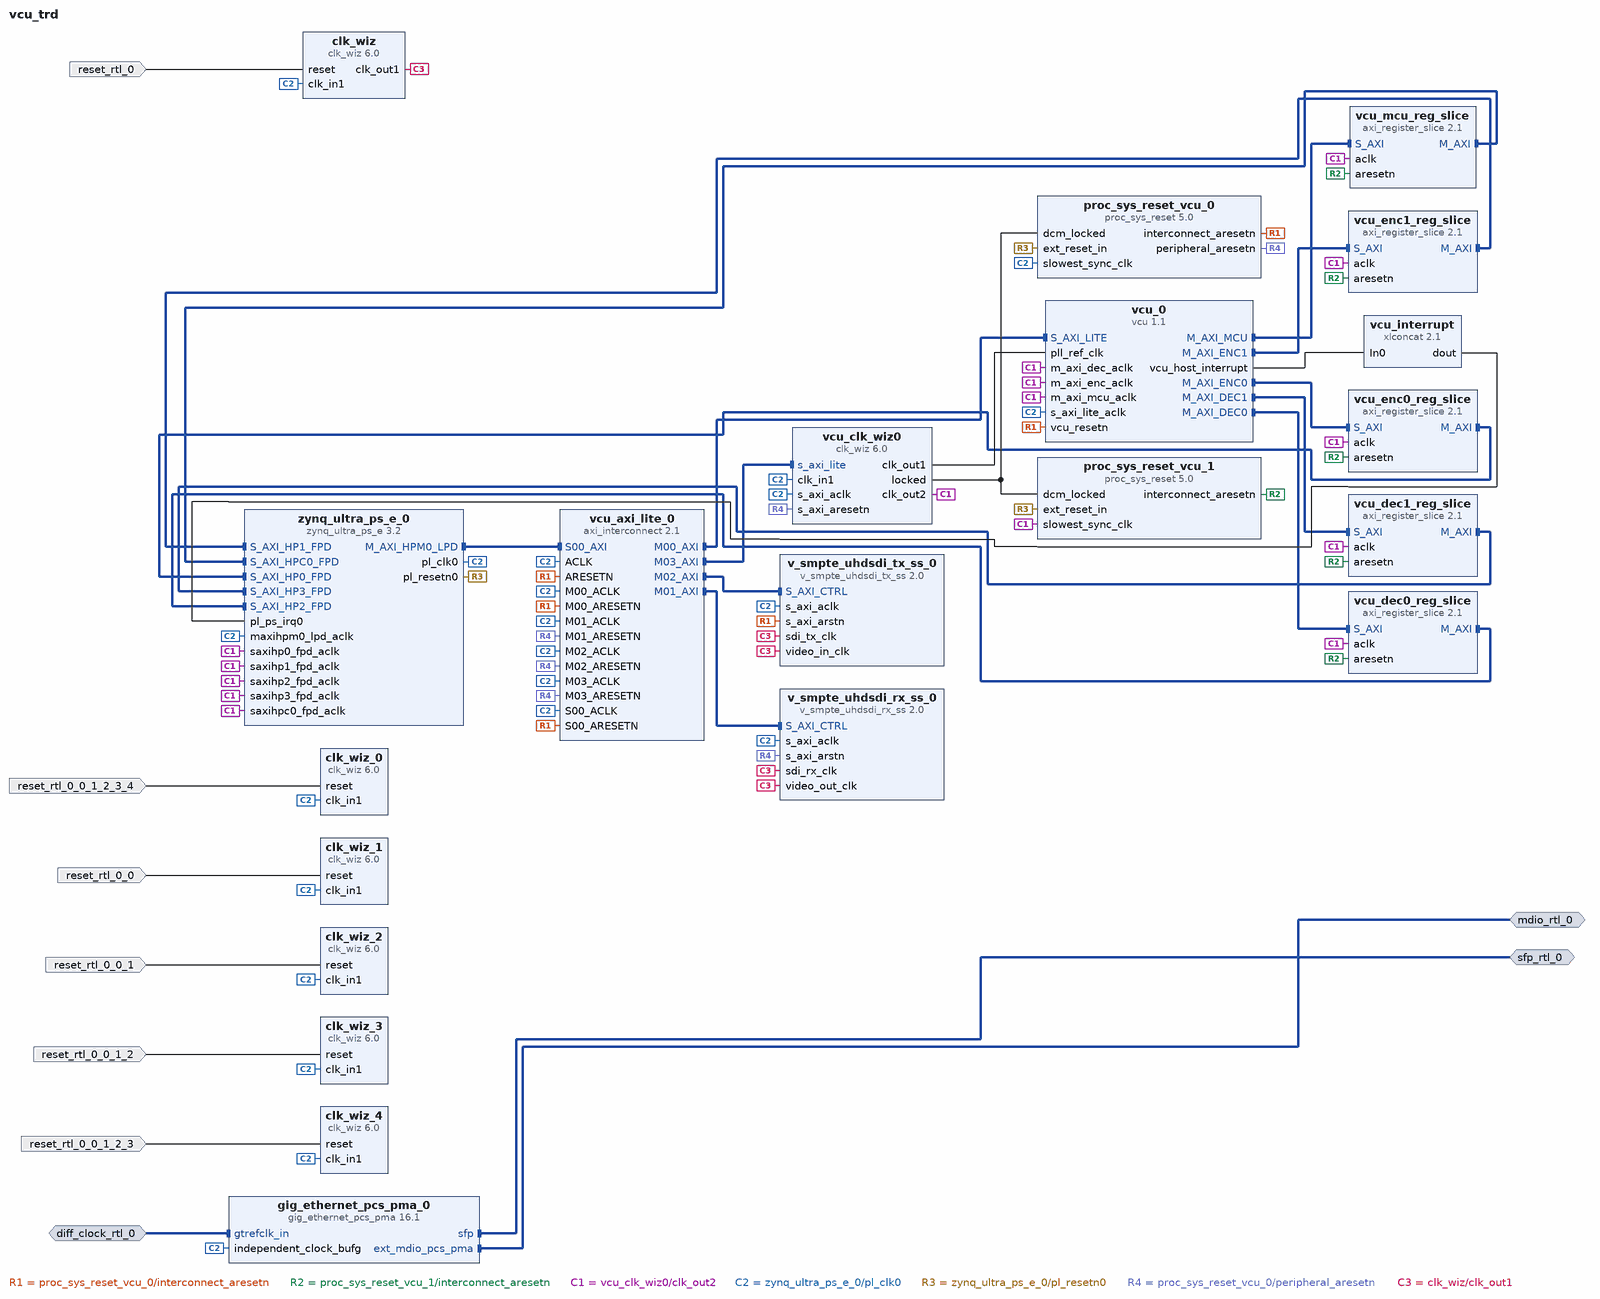
[diagram p0: block diagram of the top level]
# Vivado block design vcu_trd, xczu7ev-fbvb900-1-i, Vivado 2018.2
create_bd_design vcu_trd

create_bd_intf_port -mode Master -vlnv xilinx.com:interface:sfp_rtl:1.0 sfp_rtl_0
create_bd_intf_port -mode Master -vlnv xilinx.com:interface:mdio_rtl:1.0 mdio_rtl_0
create_bd_intf_port -mode Slave -vlnv xilinx.com:interface:diff_clock_rtl:1.0 diff_clock_rtl_0
set_property -dict {CONFIG.FREQ_HZ 100000000} [get_bd_intf_ports diff_clock_rtl_0]
create_bd_port -dir I -type rst reset_rtl_0
set_property -dict {CONFIG.POLARITY ACTIVE_HIGH} [get_bd_ports reset_rtl_0]
create_bd_port -dir I -type rst reset_rtl_0_0
set_property -dict {CONFIG.POLARITY ACTIVE_HIGH} [get_bd_ports reset_rtl_0_0]
create_bd_port -dir I -type rst reset_rtl_0_0_1
set_property -dict {CONFIG.POLARITY ACTIVE_HIGH} [get_bd_ports reset_rtl_0_0_1]
create_bd_port -dir I -type rst reset_rtl_0_0_1_2
set_property -dict {CONFIG.POLARITY ACTIVE_HIGH} [get_bd_ports reset_rtl_0_0_1_2]
create_bd_port -dir I -type rst reset_rtl_0_0_1_2_3
set_property -dict {CONFIG.POLARITY ACTIVE_HIGH} [get_bd_ports reset_rtl_0_0_1_2_3]
create_bd_port -dir I -type rst reset_rtl_0_0_1_2_3_4
set_property -dict {CONFIG.POLARITY ACTIVE_HIGH} [get_bd_ports reset_rtl_0_0_1_2_3_4]

create_bd_cell -type ip -vlnv xilinx.com:ip:vcu:1.1 vcu_0
set_property -dict [list \
  CONFIG.NO_OF_STREAMS 4 \
  CONFIG.ENC_CODING_TYPE 1 \
  CONFIG.ENC_FRAME_SIZE 1 \
  CONFIG.ENC_FPS 3 \
  CONFIG.ENC_BUFFER_EN true \
  CONFIG.ENC_BUFFER_TYPE 2 \
  CONFIG.DEC_FRAME_SIZE 3 \
  CONFIG.DEC_FPS 3 \
  CONFIG.DEC_CODING_TYPE 1 \
  CONFIG.ENC_BUFFER_SIZE_ACTUAL 2975 \
  CONFIG.ENC_BUFFER_MOTION_VEC_RANGE 1 \
  CONFIG.ENC_BUFFER_B_FRAME 2 \
  CONFIG.ENC_MEM_URAM_USED 0 \
  CONFIG.TABLE_NO 3 \
] [get_bd_cells vcu_0]
create_bd_cell -type ip -vlnv xilinx.com:ip:proc_sys_reset:5.0 proc_sys_reset_vcu_0
create_bd_cell -type ip -vlnv xilinx.com:ip:proc_sys_reset:5.0 proc_sys_reset_vcu_1
create_bd_cell -type ip -vlnv xilinx.com:ip:axi_register_slice:2.1 vcu_enc0_reg_slice
create_bd_cell -type ip -vlnv xilinx.com:ip:axi_register_slice:2.1 vcu_enc1_reg_slice
create_bd_cell -type ip -vlnv xilinx.com:ip:axi_register_slice:2.1 vcu_dec0_reg_slice
create_bd_cell -type ip -vlnv xilinx.com:ip:axi_register_slice:2.1 vcu_dec1_reg_slice
create_bd_cell -type ip -vlnv xilinx.com:ip:axi_register_slice:2.1 vcu_mcu_reg_slice
create_bd_cell -type ip -vlnv xilinx.com:ip:axi_interconnect:2.1 vcu_axi_lite_0
set_property -dict {CONFIG.NUM_MI 4} [get_bd_cells vcu_axi_lite_0]
create_bd_cell -type ip -vlnv xilinx.com:ip:clk_wiz:6.0 vcu_clk_wiz0
set_property -dict [list \
  CONFIG.USE_PHASE_ALIGNMENT false \
  CONFIG.USE_DYN_PHASE_SHIFT false \
  CONFIG.USE_DYN_RECONFIG true \
  CONFIG.SECONDARY_SOURCE Single_ended_clock_capable_pin \
  CONFIG.CLKOUT2_USED true \
  CONFIG.NUM_OUT_CLKS 2 \
  CONFIG.CLKOUT1_REQUESTED_OUT_FREQ 33 \
  CONFIG.CLKOUT2_REQUESTED_OUT_FREQ 167 \
  CONFIG.CLKOUT1_DRIVES Buffer \
  CONFIG.CLKOUT2_DRIVES Buffer \
  CONFIG.CLKOUT3_DRIVES Buffer \
  CONFIG.CLKOUT4_DRIVES Buffer \
  CONFIG.CLKOUT5_DRIVES Buffer \
  CONFIG.CLKOUT6_DRIVES Buffer \
  CONFIG.CLKOUT7_DRIVES Buffer \
  CONFIG.RESET_PORT reset \
  CONFIG.MMCM_DIVCLK_DIVIDE 8 \
  CONFIG.MMCM_CLKFBOUT_MULT_F 120.125 \
  CONFIG.MMCM_CLKOUT0_DIVIDE_F 45.500 \
  CONFIG.MMCM_CLKOUT1_DIVIDE 9 \
  CONFIG.RESET_TYPE ACTIVE_HIGH \
  CONFIG.CLKOUT1_JITTER 173.386 \
  CONFIG.CLKOUT1_PHASE_ERROR 253.265 \
  CONFIG.CLKOUT2_JITTER 139.003 \
  CONFIG.CLKOUT2_PHASE_ERROR 253.265 \
  CONFIG.PHASE_DUTY_CONFIG false \
] [get_bd_cells vcu_clk_wiz0]
create_bd_cell -type ip -vlnv xilinx.com:ip:zynq_ultra_ps_e:3.2 zynq_ultra_ps_e_0
set_property -dict [list \
  CONFIG.PSU__USE__S_AXI_GP0 1 \
  CONFIG.PSU__SAXIGP0__DATA_WIDTH 32 \
  CONFIG.PSU__USE__S_AXI_GP2 1 \
  CONFIG.PSU__USE__S_AXI_GP3 1 \
  CONFIG.PSU__USE__S_AXI_GP4 1 \
  CONFIG.PSU__USE__S_AXI_GP5 1 \
  CONFIG.PSU__USE__IRQ0 1 \
  CONFIG.PSU__DDR_HIGH_ADDRESS_GUI_ENABLE 0 \
] [get_bd_cells zynq_ultra_ps_e_0]
# 9 more settings of zynq_ultra_ps_e_0 are not shown: defaults, MIO pin electricals, DDR timing, and values the tool derives
create_bd_cell -type ip -vlnv xilinx.com:ip:xlconcat:2.1 vcu_interrupt
set_property -dict {CONFIG.NUM_PORTS 1} [get_bd_cells vcu_interrupt]
create_bd_cell -type ip -vlnv xilinx.com:ip:gig_ethernet_pcs_pma:16.1 gig_ethernet_pcs_pma_0
set_property -dict [list \
  CONFIG.Standard BOTH \
  CONFIG.MaxDataRate 1G \
  CONFIG.Ext_Management_Interface true \
  CONFIG.EMAC_IF_TEMAC TEMAC \
  CONFIG.SupportLevel Include_Shared_Logic_in_Core \
  CONFIG.TransceiverControl false \
] [get_bd_cells gig_ethernet_pcs_pma_0]
create_bd_cell -type ip -vlnv xilinx.com:ip:clk_wiz:6.0 clk_wiz
create_bd_cell -type ip -vlnv xilinx.com:ip:clk_wiz:6.0 clk_wiz_1
create_bd_cell -type ip -vlnv xilinx.com:ip:clk_wiz:6.0 clk_wiz_2
create_bd_cell -type ip -vlnv xilinx.com:ip:clk_wiz:6.0 clk_wiz_3
create_bd_cell -type ip -vlnv xilinx.com:ip:clk_wiz:6.0 clk_wiz_4
create_bd_cell -type ip -vlnv xilinx.com:ip:v_smpte_uhdsdi_rx_ss:2.0 v_smpte_uhdsdi_rx_ss_0
create_bd_cell -type ip -vlnv xilinx.com:ip:v_smpte_uhdsdi_tx_ss:2.0 v_smpte_uhdsdi_tx_ss_0
create_bd_cell -type ip -vlnv xilinx.com:ip:clk_wiz:6.0 clk_wiz_0

# ---- connections ----

connect_bd_intf_net -intf_net vcu_enc_00_axi [get_bd_intf_pins vcu_enc0_reg_slice/S_AXI] [get_bd_intf_pins vcu_0/M_AXI_ENC0]
connect_bd_intf_net -intf_net vcu_enc_10_axi [get_bd_intf_pins vcu_enc1_reg_slice/S_AXI] [get_bd_intf_pins vcu_0/M_AXI_ENC1]
connect_bd_intf_net -intf_net vcu_enc_01_axi [get_bd_intf_pins vcu_enc0_reg_slice/M_AXI] [get_bd_intf_pins zynq_ultra_ps_e_0/S_AXI_HP0_FPD]
connect_bd_intf_net -intf_net vcu_enc_11_axi [get_bd_intf_pins vcu_enc1_reg_slice/M_AXI] [get_bd_intf_pins zynq_ultra_ps_e_0/S_AXI_HP1_FPD]
connect_bd_intf_net -intf_net vcu_dec_00_axi [get_bd_intf_pins vcu_dec0_reg_slice/S_AXI] [get_bd_intf_pins vcu_0/M_AXI_DEC0]
connect_bd_intf_net -intf_net vcu_dec_10_axi [get_bd_intf_pins vcu_dec1_reg_slice/S_AXI] [get_bd_intf_pins vcu_0/M_AXI_DEC1]
connect_bd_intf_net -intf_net vcu_dec_01_axi [get_bd_intf_pins vcu_dec0_reg_slice/M_AXI] [get_bd_intf_pins zynq_ultra_ps_e_0/S_AXI_HP2_FPD]
connect_bd_intf_net -intf_net vcu_dec_11_axi [get_bd_intf_pins vcu_dec1_reg_slice/M_AXI] [get_bd_intf_pins zynq_ultra_ps_e_0/S_AXI_HP3_FPD]
connect_bd_intf_net -intf_net vcu_mcu_axi [get_bd_intf_pins vcu_mcu_reg_slice/S_AXI] [get_bd_intf_pins vcu_0/M_AXI_MCU]
connect_bd_intf_net -intf_net vcu_mcu_axi_1 [get_bd_intf_pins vcu_mcu_reg_slice/M_AXI] [get_bd_intf_pins zynq_ultra_ps_e_0/S_AXI_HPC0_FPD]
connect_bd_intf_net -intf_net vcu_2_axi_lite [get_bd_intf_pins vcu_0/S_AXI_LITE] [get_bd_intf_pins vcu_axi_lite_0/M00_AXI]
connect_bd_intf_net -intf_net axi_lite_2_zynq [get_bd_intf_pins zynq_ultra_ps_e_0/M_AXI_HPM0_LPD] [get_bd_intf_pins vcu_axi_lite_0/S00_AXI]
connect_bd_intf_net [get_bd_intf_pins vcu_axi_lite_0/M01_AXI] [get_bd_intf_pins v_smpte_uhdsdi_rx_ss_0/S_AXI_CTRL]
connect_bd_intf_net [get_bd_intf_pins vcu_axi_lite_0/M02_AXI] [get_bd_intf_pins v_smpte_uhdsdi_tx_ss_0/S_AXI_CTRL]
connect_bd_intf_net [get_bd_intf_pins vcu_axi_lite_0/M03_AXI] [get_bd_intf_pins vcu_clk_wiz0/s_axi_lite]
connect_bd_intf_net [get_bd_intf_ports sfp_rtl_0] [get_bd_intf_pins gig_ethernet_pcs_pma_0/sfp]
connect_bd_intf_net [get_bd_intf_ports mdio_rtl_0] [get_bd_intf_pins gig_ethernet_pcs_pma_0/ext_mdio_pcs_pma]
connect_bd_intf_net -intf_net diff_clock_rtl_0_1 [get_bd_intf_ports diff_clock_rtl_0] [get_bd_intf_pins gig_ethernet_pcs_pma_0/gtrefclk_in]
connect_bd_net -net axi_lite_reset_10 [get_bd_pins proc_sys_reset_vcu_0/interconnect_aresetn] \
  [get_bd_pins vcu_0/vcu_resetn] [get_bd_pins vcu_axi_lite_0/ARESETN] [get_bd_pins vcu_axi_lite_0/S00_ARESETN] \
  [get_bd_pins vcu_axi_lite_0/M00_ARESETN] [get_bd_pins v_smpte_uhdsdi_tx_ss_0/s_axi_arstn]
connect_bd_net -net vcu_reset_slice4 [get_bd_pins proc_sys_reset_vcu_1/interconnect_aresetn] \
  [get_bd_pins vcu_enc0_reg_slice/aresetn] [get_bd_pins vcu_enc1_reg_slice/aresetn] [get_bd_pins vcu_dec0_reg_slice/aresetn] \
  [get_bd_pins vcu_dec1_reg_slice/aresetn] [get_bd_pins vcu_mcu_reg_slice/aresetn]
connect_bd_net -net pl_clk10 [get_bd_pins vcu_clk_wiz0/clk_out2] \
  [get_bd_pins vcu_enc0_reg_slice/aclk] [get_bd_pins vcu_0/m_axi_enc_aclk] [get_bd_pins vcu_enc1_reg_slice/aclk] \
  [get_bd_pins zynq_ultra_ps_e_0/saxihp0_fpd_aclk] [get_bd_pins zynq_ultra_ps_e_0/saxihp1_fpd_aclk] \
  [get_bd_pins vcu_dec0_reg_slice/aclk] [get_bd_pins vcu_0/m_axi_dec_aclk] [get_bd_pins vcu_dec1_reg_slice/aclk] \
  [get_bd_pins zynq_ultra_ps_e_0/saxihp2_fpd_aclk] [get_bd_pins zynq_ultra_ps_e_0/saxihp3_fpd_aclk] \
  [get_bd_pins vcu_mcu_reg_slice/aclk] [get_bd_pins vcu_0/m_axi_mcu_aclk] [get_bd_pins zynq_ultra_ps_e_0/saxihpc0_fpd_aclk] \
  [get_bd_pins proc_sys_reset_vcu_1/slowest_sync_clk]
connect_bd_net -net pl_clk01 [get_bd_pins zynq_ultra_ps_e_0/pl_clk0] \
  [get_bd_pins vcu_0/s_axi_lite_aclk] [get_bd_pins vcu_axi_lite_0/ACLK] [get_bd_pins vcu_axi_lite_0/S00_ACLK] \
  [get_bd_pins vcu_axi_lite_0/M00_ACLK] [get_bd_pins zynq_ultra_ps_e_0/maxihpm0_lpd_aclk] \
  [get_bd_pins proc_sys_reset_vcu_0/slowest_sync_clk] [get_bd_pins vcu_clk_wiz0/clk_in1] \
  [get_bd_pins gig_ethernet_pcs_pma_0/independent_clock_bufg] [get_bd_pins clk_wiz/clk_in1] [get_bd_pins clk_wiz_1/clk_in1] \
  [get_bd_pins clk_wiz_2/clk_in1] [get_bd_pins clk_wiz_3/clk_in1] [get_bd_pins clk_wiz_4/clk_in1] \
  [get_bd_pins v_smpte_uhdsdi_rx_ss_0/s_axi_aclk] [get_bd_pins vcu_axi_lite_0/M01_ACLK] \
  [get_bd_pins v_smpte_uhdsdi_tx_ss_0/s_axi_aclk] [get_bd_pins vcu_axi_lite_0/M02_ACLK] [get_bd_pins clk_wiz_0/clk_in1] \
  [get_bd_pins vcu_clk_wiz0/s_axi_aclk] [get_bd_pins vcu_axi_lite_0/M03_ACLK]
connect_bd_net -net vcu_ref_clk [get_bd_pins vcu_clk_wiz0/clk_out1] [get_bd_pins vcu_0/pll_ref_clk]
connect_bd_net -net pl_reset_axi [get_bd_pins zynq_ultra_ps_e_0/pl_resetn0] \
  [get_bd_pins proc_sys_reset_vcu_0/ext_reset_in] [get_bd_pins proc_sys_reset_vcu_1/ext_reset_in]
connect_bd_net -net vcu_clk_locked2 [get_bd_pins vcu_clk_wiz0/locked] \
  [get_bd_pins proc_sys_reset_vcu_0/dcm_locked] [get_bd_pins proc_sys_reset_vcu_1/dcm_locked]
connect_bd_net -net vcu_irq_to_ps [get_bd_pins vcu_interrupt/dout] [get_bd_pins zynq_ultra_ps_e_0/pl_ps_irq0]
connect_bd_net -net vcu_irq [get_bd_pins vcu_0/vcu_host_interrupt] [get_bd_pins vcu_interrupt/In0]
connect_bd_net -net reset_rtl_0_1 [get_bd_ports reset_rtl_0] [get_bd_pins clk_wiz/reset]
connect_bd_net -net reset_rtl_0_0_1 [get_bd_ports reset_rtl_0_0] [get_bd_pins clk_wiz_1/reset]
connect_bd_net -net reset_rtl_0_0_1_1 [get_bd_ports reset_rtl_0_0_1] [get_bd_pins clk_wiz_2/reset]
connect_bd_net -net reset_rtl_0_0_1_2_1 [get_bd_ports reset_rtl_0_0_1_2] [get_bd_pins clk_wiz_3/reset]
connect_bd_net -net reset_rtl_0_0_1_2_3_1 [get_bd_ports reset_rtl_0_0_1_2_3] [get_bd_pins clk_wiz_4/reset]
connect_bd_net [get_bd_pins proc_sys_reset_vcu_0/peripheral_aresetn] \
  [get_bd_pins v_smpte_uhdsdi_rx_ss_0/s_axi_arstn] [get_bd_pins vcu_axi_lite_0/M01_ARESETN] \
  [get_bd_pins vcu_axi_lite_0/M02_ARESETN] [get_bd_pins vcu_clk_wiz0/s_axi_aresetn] [get_bd_pins vcu_axi_lite_0/M03_ARESETN]
connect_bd_net -net reset_rtl_0_0_1_2_3_4_1 [get_bd_ports reset_rtl_0_0_1_2_3_4] [get_bd_pins clk_wiz_0/reset]
connect_bd_net [get_bd_pins clk_wiz/clk_out1] \
  [get_bd_pins v_smpte_uhdsdi_rx_ss_0/sdi_rx_clk] [get_bd_pins v_smpte_uhdsdi_rx_ss_0/video_out_clk] \
  [get_bd_pins v_smpte_uhdsdi_tx_ss_0/sdi_tx_clk] [get_bd_pins v_smpte_uhdsdi_tx_ss_0/video_in_clk]

# ---- address map ----
assign_bd_address -offset 0x00000000000 -range 2G -target_address_space [get_bd_addr_spaces vcu_0/Code] [get_bd_addr_segs zynq_ultra_ps_e_0/SAXIGP0/HPC0_DDR_LOW]
assign_bd_address -offset 0x000FF000000 -range 16M -target_address_space [get_bd_addr_spaces vcu_0/DecData0] [get_bd_addr_segs zynq_ultra_ps_e_0/SAXIGP4/HP2_LPS_OCM]
assign_bd_address -offset 0x00000000000 -range 2G -target_address_space [get_bd_addr_spaces vcu_0/DecData1] [get_bd_addr_segs zynq_ultra_ps_e_0/SAXIGP5/HP3_DDR_LOW]
assign_bd_address -offset 0x00000000000 -range 2G -target_address_space [get_bd_addr_spaces vcu_0/EncData0] [get_bd_addr_segs zynq_ultra_ps_e_0/SAXIGP2/HP0_DDR_LOW]
assign_bd_address -offset 0x00000000000 -range 2G -target_address_space [get_bd_addr_spaces vcu_0/EncData1] [get_bd_addr_segs zynq_ultra_ps_e_0/SAXIGP3/HP1_DDR_LOW]
assign_bd_address -offset 0x00080000000 -range 1M -target_address_space [get_bd_addr_spaces zynq_ultra_ps_e_0/Data] [get_bd_addr_segs vcu_0/S_AXI_LITE/Reg]
assign_bd_address -offset 0x00080100000 -range 64K -target_address_space [get_bd_addr_spaces zynq_ultra_ps_e_0/Data] [get_bd_addr_segs v_smpte_uhdsdi_rx_ss_0/S_AXI_CTRL/Reg]
assign_bd_address -offset 0x00080110000 -range 64K -target_address_space [get_bd_addr_spaces zynq_ultra_ps_e_0/Data] [get_bd_addr_segs vcu_clk_wiz0/s_axi_lite/Reg]
assign_bd_address -offset 0x00080120000 -range 128K -target_address_space [get_bd_addr_spaces zynq_ultra_ps_e_0/Data] [get_bd_addr_segs v_smpte_uhdsdi_tx_ss_0/S_AXI_CTRL/Reg]

validate_bd_design
save_bd_design
